# EAGLE design blink1mk3_005t6_5050_4l (EAGLE 9.4.2)
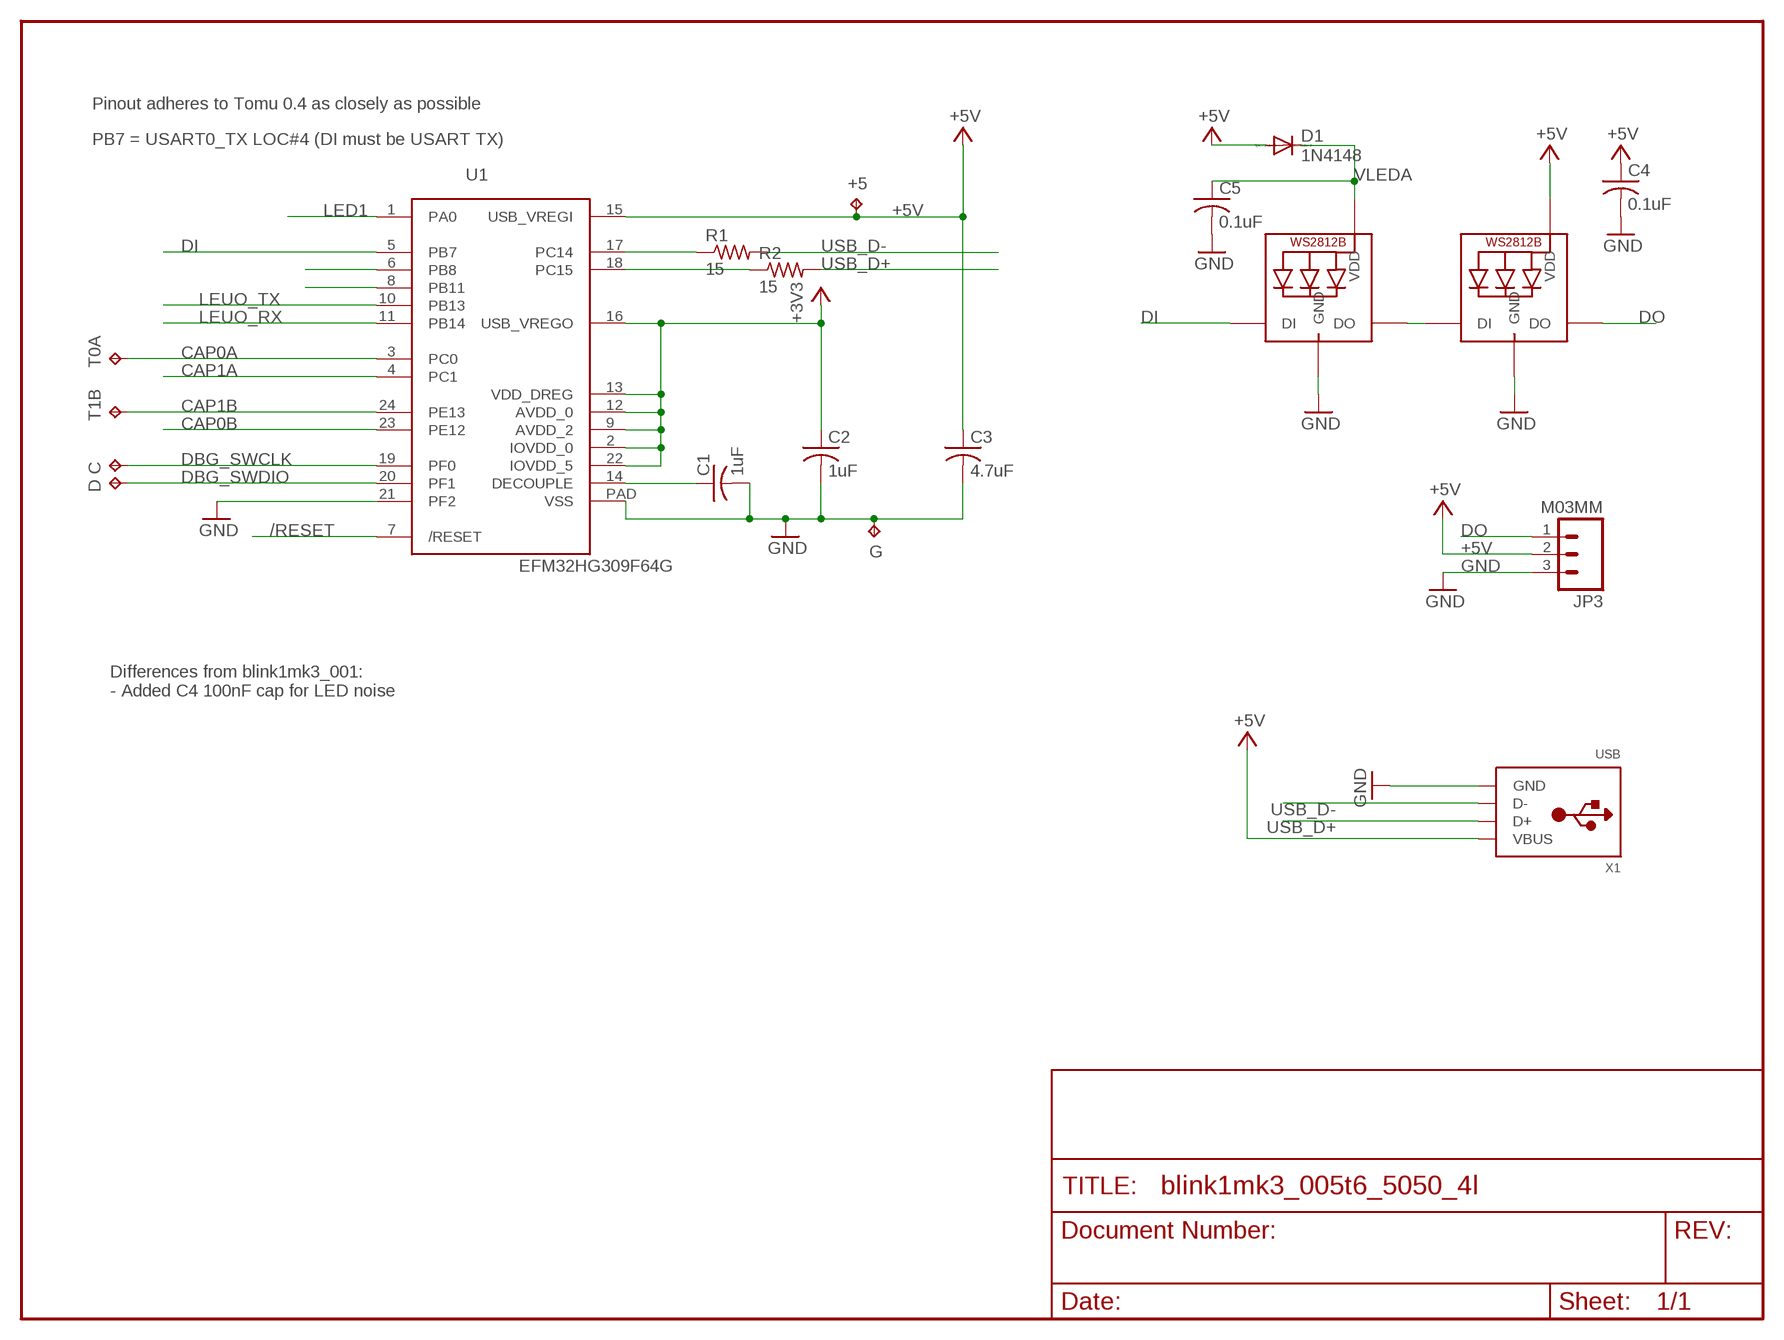
[diagram p0: schematic, sheet 1]

## Parts
+5  TPTP10R  [TP10R]
C  TPTP10R  [TP10R]
C1  1uF  C-USC0402  [C0402]
C2  1uF  C-USC0402  [C0402]
C3  4.7uF  C-USC0402  [C0402]
C4  0.1uF  C-USC0402  [C0402]
C5  0.1uF  C-USC0402  [C0402]
D  TPTP10R  [TP10R]
D1  1N4148  DIODE-SOD523  [SOD523]
G  TPTP10R  [TP10R]
JP3  M03MM  [1X03-1.5MM]
LED1  SK6812MINI  WS2812B5050  [WS2812B]
LED2  SK6812MINI  WS2812B5050  [WS2812B]
R1  15  R-US_R0402  [R0402]
R2  15  R-US_R0402  [R0402]
T0A  TPTP15R  [TP15R]
T1B  TPTP15R  [TP15R]
U1  EFM32HG309F64G  [QFN24PAD]
X1  USB  [MOLEX-48037-1000]

## Nets
+3V3: C2.1 U1.2(IOVDD_0) U1.9(AVDD_2) U1.12(AVDD_0) U1.13(VDD_DREG) U1.16(USB_VREGO) U1.22(IOVDD_5)
+5V: +5.TP C3.1 C4.1 D1.A JP3.2 LED2.1-VDD(VDD) U1.15(USB_VREGI) X1.1(VBUS)
/RESET: U1.7(/RESET)
CAP0A: T0A.TP U1.3(PC0)
CAP0B: U1.23(PE12)
CAP1A: U1.4(PC1)
CAP1B: T1B.TP U1.24(PE13)
DBG_SWCLK: C.TP U1.19(PF0)
DBG_SWDIO: D.TP U1.20(PF1)
DECOUPLE: C1.1 U1.14(DECOUPLE)
DI: LED1.4-DIN(DI) U1.5(PB7)
DO: JP3.1 LED2.2-DOUT(DO)
GND: C1.2 C2.2 C3.2 C4.2 C5.2 G.TP JP3.3 LED1.3-GND(GND) LED2.3-GND(GND) U1.21(PF2) U1.PAD(VSS) X1.4(GND)
LED1: U1.1(PA0)
LEUO_RX: U1.11(PB14)
LEUO_TX: U1.10(PB13)
N$1: U1.8(PB11)
N$2: LED1.2-DOUT(DO) LED2.4-DIN(DI)
N$3: U1.6(PB8)
RUSB_D+: R2.1 U1.18(PC15)
RUSB_D-: R1.1 U1.17(PC14)
USB_D+: R2.2 X1.3(D+)
USB_D-: R1.2 X1.2(D-)
VLEDA: C5.1 D1.C LED1.1-VDD(VDD)

## Notes on the sheet
- Pinout adheres to Tomu 0.4 as closely as possible
- PB7 = USART0_TX LOC#4 (DI must be USART TX)
- Differences from blink1mk3_001:
  - Added C4 100nF cap for LED noise

## Library data of the parts
+5 C D G T0A T1B = testpad:TP: Test pad
C1-C5 = adafruit:C-US: CAPACITOR, American symbol
D1 = diode:DIODE-: DIODE
JP3 = todstuff:M03
LED1 LED2 = adafruit:WS2812B
R1 R2 = adafruit:R-US_: RESISTOR, American symbol
U1 = todstuff:EFM32HG309F64G
X1 = todstuff:USB

## Board
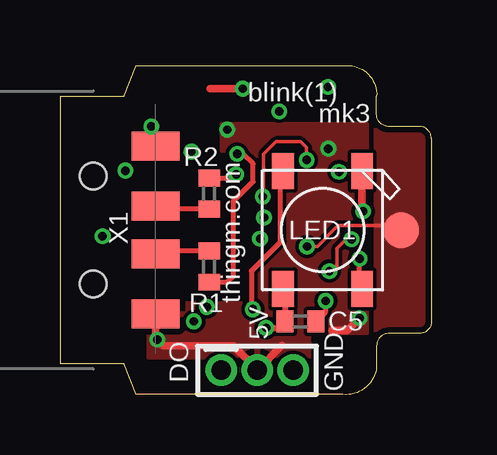
[diagram p1: board, top side]
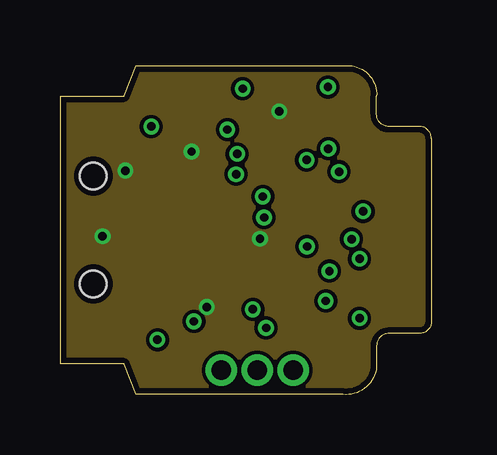
[diagram p2: board, inner layer Route2]
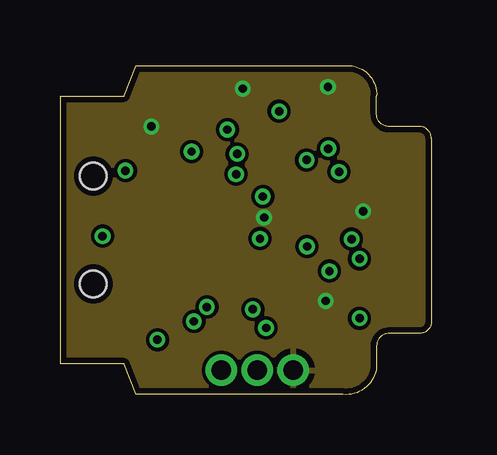
[diagram p3: board, inner layer Route15]
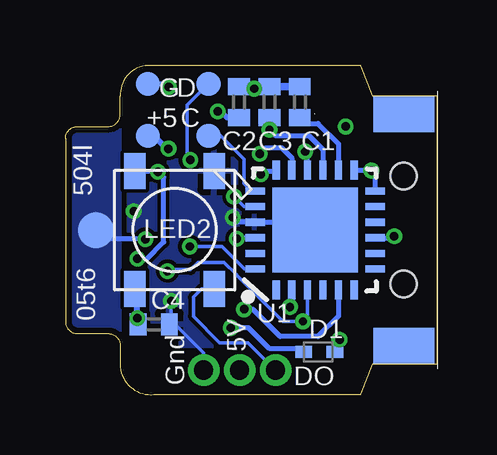
[diagram p4: board, bottom side, seen from below]

Size 15.49 x 13.72 mm. Coordinates in mm from the lower left corner, seen from the top.
Outline: 0,12.45 2.67,12.45 3.17,13.72 12.06,13.72 arc-90 13.21,12.45 13.21,11.69 arc90 13.72,11.18 14.99,11.18 arc-90 15.49,10.67 15.49,3.05 arc-90 14.99,2.55 13.72,2.55 arc90 13.21,2.04 13.21,1.15 arc-90 11.81,0.01 3.17,0.01 2.67,1.28 0,1.28 0,12.45
Copper layers (1+2*15+16): Top 0.035mm / dielectric 1.5mm / Route2 0.0175mm / dielectric 1.1mm / Route15 0.0175mm / dielectric 0.2mm / Bottom 0.035mm
Design rules "SeeedStudio_2layer_DRU_no_angle_20140221 *": minimum track width 6mil, minimum drill 12mil, track to track 6mil, track to pad 6mil, pad to pad 6mil, via to via 6mil, smd to smd 0mil, copper to edge 10mil, drill to drill 10mil, minimum pad ring 10mil, minimum via ring 6mil, stop-mask expansion 2mil, vias tented up to drill 100mil, thermal gap 10mil

### Footprints (pad centres in the part's own frame; a part is rotated, then mirrored left to right if it is on the bottom)
TP10R = smd 1 x 1: TP 0,0
C0402 = smd 0.7 x 0.9: 1 -0.65,0; 2 0.65,0
SOD523 = smd 0.7 x 0.5: A 0.7,0; C -0.6,0
1X03-1.5MM = drill 0.8 pad 1.27: 1 0,0; 2 1.5,0; 3 3,0
WS2812B = smd 1.5 x 0.9: 1-VDD 2.45,-1.65; 2-DOUT 2.45,1.65; 3-GND -2.45,1.65; 4-DIN -2.45,-1.65
R0402 = smd 0.7 x 0.9: 1 -0.65,0; 2 0.65,0
TP15R = smd 1.5 x 1.5: TP 0,0
QFN24PAD = smd 0.8 x 0.3: 1 -2.5,1.625; 2 -2.5,0.975; 3 -2.5,0.325; 4 -2.5,-0.325; 5 -2.5,-0.975; 6 -2.5,-1.625; 13 2.5,-1.625; 14 2.5,-0.975; 15 2.5,-0.325; 16 2.5,0.325; 17 2.5,0.975; 18 2.5,1.625 | smd 0.3 x 0.8: 7 -1.625,-2.5; 8 -0.975,-2.5; 9 -0.325,-2.5; 10 0.325,-2.5; 11 0.975,-2.5; 12 1.625,-2.5; 19 1.625,2.5; 20 0.975,2.5; 21 0.325,2.5; 22 -0.325,2.5; 23 -0.975,2.5; 24 -1.625,2.5 | smd 3.55 x 3.55: PAD 0,0
MOLEX-48037-1000 = smd 2 x 1.2: 1 2.6,-3.5; 2 2.6,-1; 3 2.6,1; 4 2.6,3.5 | smd 2.54 x 1.524 bottom: P$1 0,4.85; P$2 0,-4.85 | hole 1.1: 0,2.25; 0,-2.25

### Placement (x,y rotation side)
+5  12.06,10.8 0 bottom
C  9.53,10.8 0 bottom
C1  5.71,12.2 90 bottom
C2  8.25,12.2 90 bottom
C3  6.99,12.2 90 bottom
C4  11.81,2.93 0 bottom
C5  10.03,3.05 0 top
D  9.53,12.96 0 bottom
D1  4.95,1.78 0 bottom
G  12.06,12.96 180 bottom
JP3  6.73,1.02 0 top
LED1  10.95,6.86 270 top
LED2  10.94,6.86 270 bottom
R1  6.22,5.34 90 top
R2  6.22,8.39 270 top
T0A  14.22,6.86 0 bottom
T1B  14.22,6.86 0 top
U1  5.08,6.86 90 bottom
X1  1.39,6.86 0 top

### Tracks (layer width: path | path; a pad name or v marks a point on that pad's centre or on a via)
+3V3  (via drill 0.35)
  Bottom 0.203: U1.13 2.75,9.36 v2.73,9.34 2.58,9.19 U1.12 | U1.9 1.85,6.54 v1.78,6.61 | U1.2 6.06,3.73 v6.13,3.66 | U1.22 8.31,6.54 v8.34,6.51 | U1.16 5.41,10.05 v5.49,10.14 | v9.14,11.82 9.03,11.82 8.76,11.55 C2.1
  pour Route2: 0,13.98 15.49,13.98 15.49,-0.63 0,-0.63
+5V  (via drill 0.35)
  Top 0.203: v4.06,2.29 3.99,2.37
  Top 0.254: v4.06,2.29 4.32,2.04
  Top 0.305: 4.32,2.04 7.24,2.04 8.23,1.05 JP3.2 9.27,2.06 | 3.99,2.37 X1.1 | 11.35,2.68 11.99,2.68 v12.5,3.18
  Bottom 0.152: C4.1 12.46,3.15 v12.5,3.18
  Bottom 0.203: C3.1 6.93,11.09 v6.99,11.06 6.73,10.8 5.33,10.8 4.75,10.22 U1.15 | v4.06,2.29 4.06,1.78 D1.A | +5.TP 11.81,10.8 | 12.5,4.32 LED2.1-VDD
  Bottom 0.254: v11.2,10.26 11.27,10.26 11.81,10.8 | v12.5,3.18 12.5,4.32
  pour Top: 3.68,1.53 3.68,3.82 7.87,3.82 7.87,10.17 6.73,10.17 6.73,11.31 12.82,11.31 12.83,2.55 10.41,2.55 10.41,1.53
CAP0A  (via drill 0.35)
  Top 0.152: v11.24,5.15 11.37,5.15 11.56,5.34 11.56,6.1 11.94,6.48 v12.16,6.48
  Bottom 0.152: U1.3 5.41,3.24 v5.59,3.05 6.42,3.05 8.36,4.99 8.36,5.01 8.87,5.52 9.96,5.52 10.27,5.21 11.18,5.21 v11.24,5.15
  Bottom 0.203: v12.16,6.48 13.84,6.48 T0A.TP
  pour Bottom (no thermals): 13.21,11.18 15.49,11.18 15.49,2.55 13.21,2.55
CAP1B  (via drill 0.35)
  Top 0.152: 14.04,7.05 11.6,7.05 10.73,6.18 v10.31,6.18
  Top 0.203: 14.04,7.05 T1B.TP
  Bottom 0.152: v10.31,6.18 8.96,6.18 8.03,5.24 U1.24
  pour Top (no thermals): 13.21,11.18 15.49,11.18 15.49,2.42 13.21,2.42
DBG_SWCLK
  Bottom 0.152: 7.72,8.49 8.04,8.81 8.04,9.82 9.03,10.8 C.TP
  Bottom 0.203: U1.19 7.72,8.49
DBG_SWDIO  (via drill 0.35)
  Top 0.152: v8.46,8.26 8.5,8.3 8.5,10.03 9.01,10.55 10.03,10.55 10.29,10.29 v10.29,9.79
  Bottom 0.152: v8.46,8.26 8.04,7.84 U1.20 | D.TP 10.41,12.07 10.41,9.91 v10.29,9.79
DECOUPLE
  Bottom 0.203: C1.1 5.59,11.55 5.35,11.31 4.95,11.31 4.11,10.46 U1.14
DI  (via drill 0.35)
  Top 0.203: LED1.4-DIN 9.3,9.3 9.2,9.3 9.2,6.37 7.99,5.16 7.99,3.61 v8.04,3.56
  Bottom 0.203: U1.5 4.11,3.27 4.95,2.42 6.54,2.42 7.68,3.56 v8.04,3.56
DO
  Bottom 0.152: JP3.1 7.87,2.17 9.06,2.17 10.16,3.26 10.16,4.07 9.82,4.41 LED2.2-DOUT
GND  (via drill 0.35)
  Top 0.152: X1.4 3.81,10.54
  Top 0.203: X1.4 4.64,10.36 4.75,10.47 | v12.65,7.65 12.6,7.69 | C5.2 11.08,3.46 v11.08,3.91
  Top 0.305: v7.62,12.76 6.26,12.76 | 12.6,7.69 LED1.3-GND | 3.81,10.54 v3.81,11.18
  Bottom 0.152: JP3.3 9.73,1.74 11.05,3.05 | C4.2 11.08,3 v11.08,3.91
  Bottom 0.203: U1.PAD 5.41,7.19 U1.21 8.32,7.19 v8.51,7.39 | C2.2 7.7,12.85 7.7,12.84 v7.62,12.76 | G.TP 11.3,12.96 v11.18,12.83
  Bottom 0.305: C1.2 C3.2 C2.2
  pour Bottom: 7.62,10.93 7.62,2.04 10.67,2.04 10.67,3.05 12.83,3.05 12.83,10.93
  pour Route15: 0,13.98 15.37,13.98 15.37,-0.76 -0.51,-0.76 -0.51,13.98
N$2  (via drill 0.35)
  Top 0.203: LED1.2-DOUT 12.5,4.52 v12.5,5.66
  Bottom 0.203: LED2.4-DIN 12.57,9.3 v11.64,9.3 11.4,9.06 11.4,6.36 12.1,5.66 v12.5,5.66
RUSB_D+  (via drill 0.35)
  Top 0.203: R2.1 7.19,9.04 v7.35,9.19
  Bottom 0.203: U1.18 6.75,9.32 7.22,9.32 v7.35,9.19
RUSB_D-  (via drill 0.35)
  Top 0.203: R1.1 6.97,4.69 7.24,4.96 7.24,8.06 8.05,8.88 8.05,9.63 7.64,10.04 v7.39,10.04
  Bottom 0.203: v7.39,10.04 7.14,10.29 6.48,10.29 6.06,9.87 U1.17
USB_D+
  Top 0.203: R2.2 4.71,7.74 4.57,7.88 4,7.88 X1.3
USB_D-
  Top 0.203: R1.2 4.68,5.99 4.57,6.1 4.23,6.1 X1.2
VLEDA  (via drill 0.35)
  Top 0.254: LED1.1-VDD 9.38,4.33 C5.1 9.11,2.78 v8.6,2.78
  Bottom 0.203: D1.C 5.6,1.83 5.57,1.93 7,1.93 7.87,2.8 8.58,2.8 v8.6,2.78

### Text on the board
tPlace: blink(1) | mk3 | thingm.com | 5V | DO | GND
bPlace: 504l | 05t6 | 5V | DO | Gnd